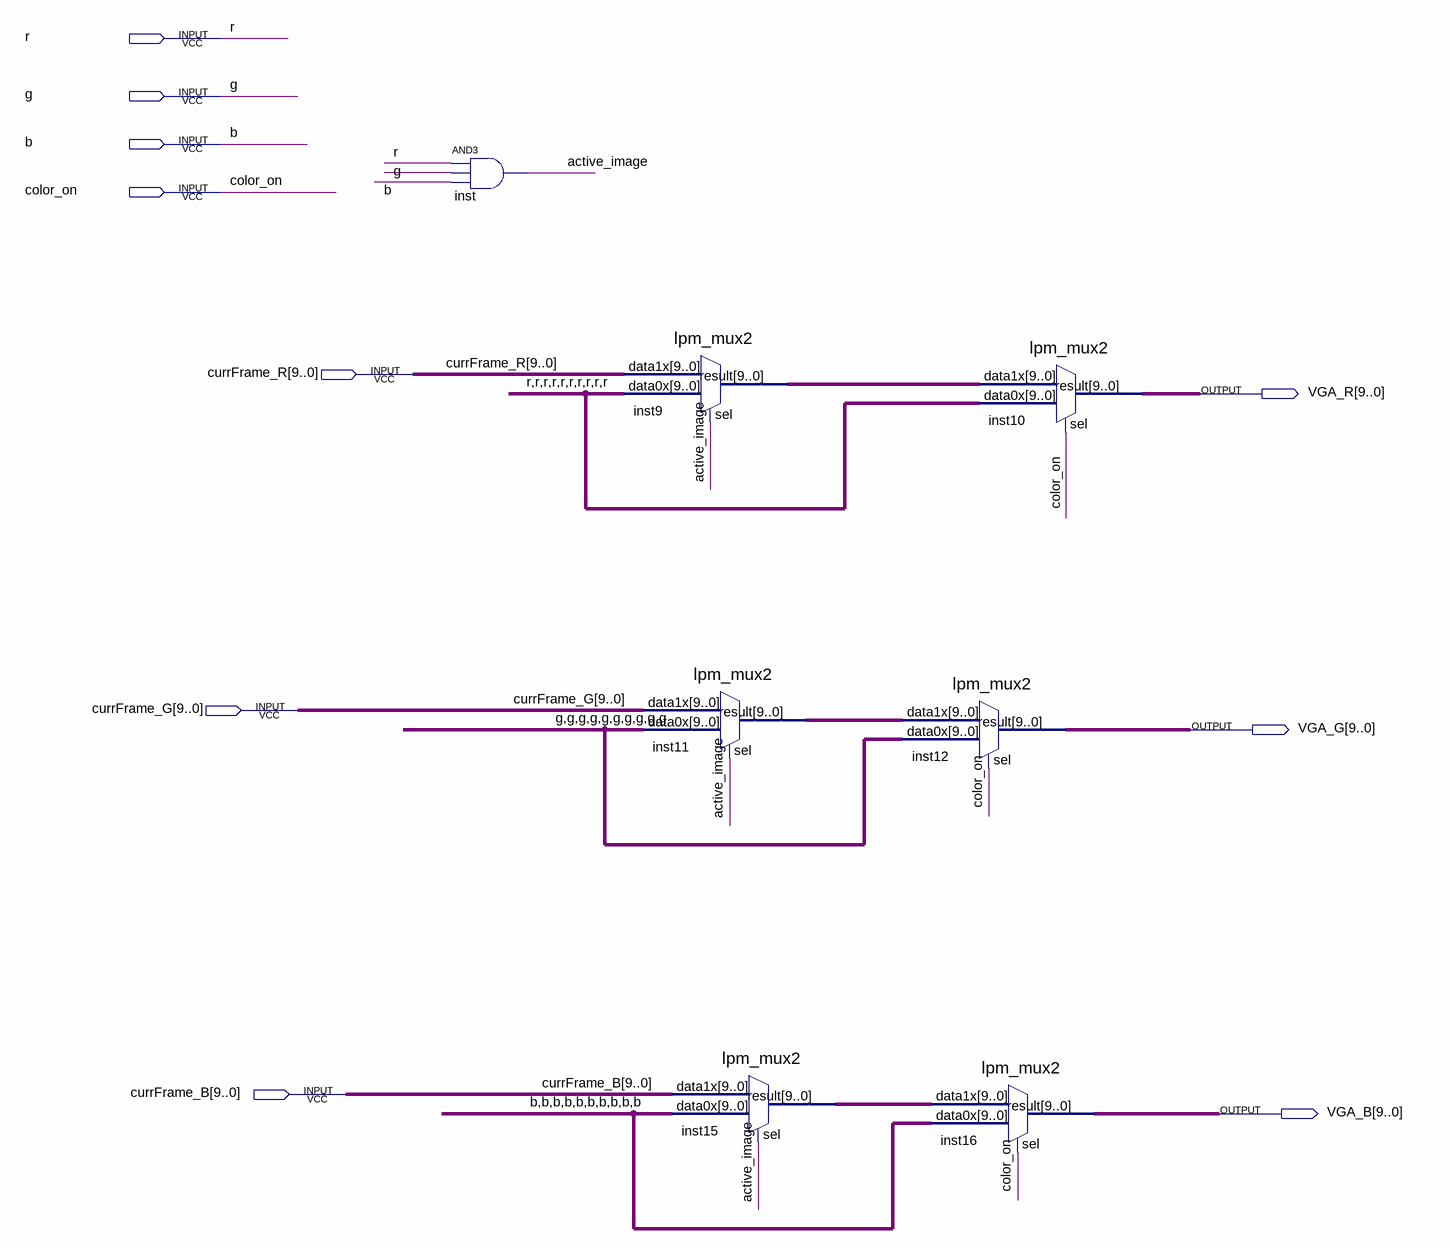
[diagram p0: schematic sheet]
// Quartus schematic colorChooser.bdf as structural Verilog: 7 symbols, 10 pins
module colorChooser (
  input  r,
  input  g,
  input  b,
  input  color_on,
  input  [9:0] currFrame_R,
  input  [9:0] currFrame_G,
  input  [9:0] currFrame_B,
  output [9:0] VGA_R,
  output [9:0] VGA_G,
  output [9:0] VGA_B
);

  wire active_image;
  wire [9:0] inst9_result, inst11_result, inst15_result;

  and inst (active_image, r, g, b);
  lpm_mux2 inst9 (.data1x(currFrame_R), .data0x({10{r}}), .sel(active_image), .result(inst9_result));
  lpm_mux2 inst11 (.data1x(currFrame_G), .data0x({10{g}}), .sel(active_image), .result(inst11_result));
  lpm_mux2 inst15 (.data1x(currFrame_B), .data0x({10{b}}), .sel(active_image), .result(inst15_result));
  lpm_mux2 inst12 (.data1x(inst11_result), .data0x({10{g}}), .sel(color_on), .result(VGA_G));
  lpm_mux2 inst16 (.data1x(inst15_result), .data0x({10{b}}), .sel(color_on), .result(VGA_B));
  lpm_mux2 inst10 (.data1x(inst9_result), .data0x({10{r}}), .sel(color_on), .result(VGA_R));
endmodule
